# Altium schematic sheet SENSOR.SchDoc
size A4; Author: Khanh BK; Organization: DB Bach Khoa HN; Address1: Bach Khoa- HBT - HN; Address2: khanh.db192932; Address3: Youtube: Đào Bá Khánh; Address4: 0357698570; Revision: 1.0Ver; SheetNumber: 4; SheetTotal: 9
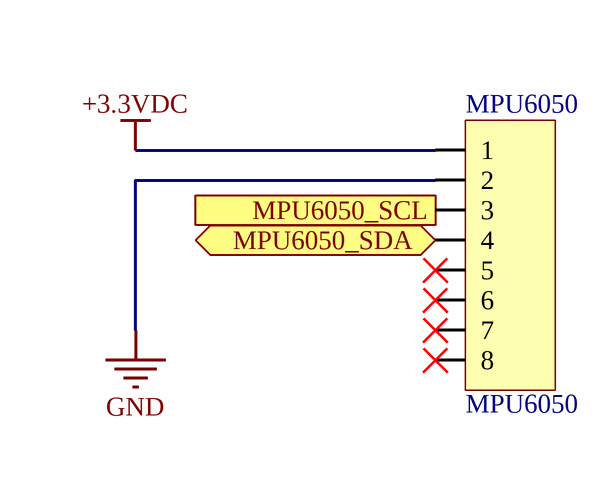
[diagram p0: SENSOR.SchDoc]

## Parts
MPU6050  MPU6050  [JP8-C1T]

## Ports
MPU6050_SCL (in), MPU6050_SDA (bidir)

## Nets
+3.3VDC: MPU6050.1
GND: MPU6050.2
MPU6050_SCL: MPU6050.3 ; port MPU6050_SCL
MPU6050_SDA: MPU6050.4 ; port MPU6050_SDA

Not connected (* = marked no-connect by the designer): MPU6050 5* 6* 7* 8*

## Notes on the sheet
- Title
- Size:
- Date:
- Author:
- A4
- Time:
- Number:
- Checked:
- Revision:
- Sheet
- Approved:
- of
- File:

## Library data of the parts
MPU6050 = JP8: WR-PHD 2.54 mm Angled Socket Header; Manufacturer: W¨¹rth Elektronik eiSos GmbH; partNo: 613008143121; ComponentLink1 Description: Manufacturer; ComponentLink2 Description: Datasheet; NoPins: 08; Created Date: 29 March 2013; ComponentLink1URL: http://www.we-online.com; ComponentLink2URL: http://katalog.we-online.de/em/datasheet/6130xx143121.pdf; Created by: Karrer Zheng